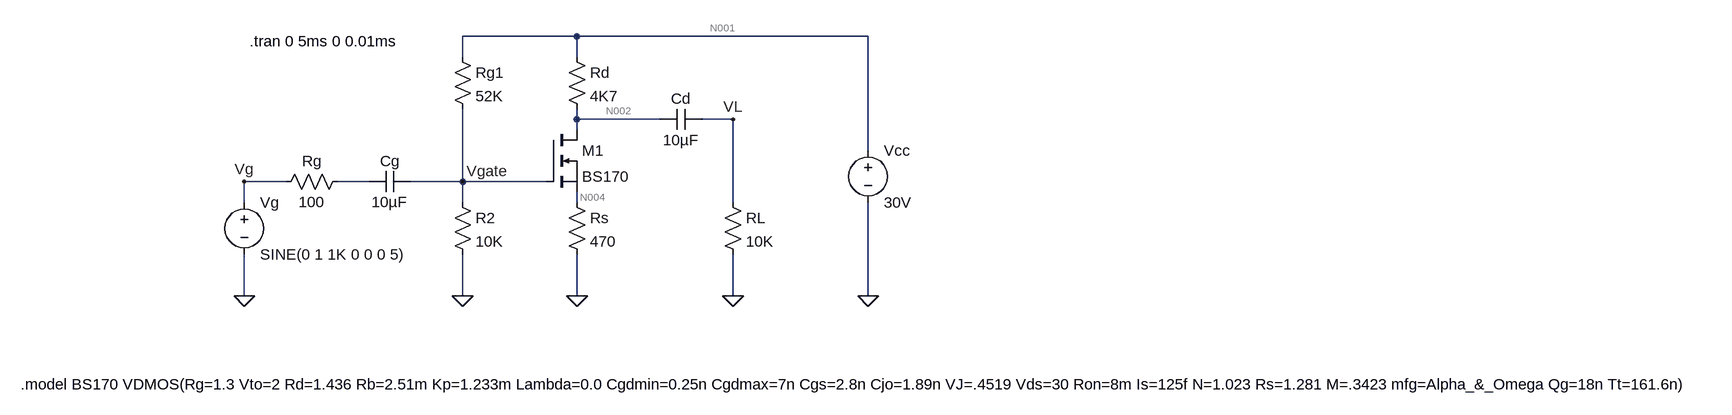
[diagram p0: schematic TPMOS3.asc]
TPMOS3.asc, the LTspice schematic file:
Version 4
SHEET 1 2460 680
WIRE 496 -128 320 -128
WIRE 944 -128 496 -128
WIRE 320 -96 320 -128
WIRE 496 -96 496 -128
WIRE 496 0 496 -16
WIRE 624 0 496 0
WIRE 736 0 688 0
WIRE 496 16 496 0
WIRE 944 48 944 -128
WIRE 48 96 -16 96
WIRE 176 96 128 96
WIRE 320 96 320 -16
WIRE 320 96 240 96
WIRE 448 96 320 96
WIRE -16 128 -16 96
WIRE 320 128 320 96
WIRE 496 128 496 112
WIRE 736 128 736 0
WIRE -16 272 -16 208
WIRE 320 272 320 208
WIRE 496 272 496 208
WIRE 736 272 736 208
WIRE 944 272 944 128
FLAG -16 272 0
FLAG 320 272 0
FLAG 496 272 0
FLAG 736 272 0
FLAG 944 272 0
FLAG 320 96 Vgate
FLAG 736 0 VL
FLAG -16 96 Vg
SYMBOL voltage -16 112 R0
WINDOW 123 0 0 Left 0
WINDOW 39 0 0 Left 0
SYMATTR InstName Vg
SYMATTR Value SINE(0 1 1K 0 0 0 5)
SYMBOL res 144 80 R90
WINDOW 0 0 56 VBottom 2
WINDOW 3 32 56 VTop 2
SYMATTR InstName Rg
SYMATTR Value 100
SYMBOL cap 240 80 R90
WINDOW 0 0 32 VBottom 2
WINDOW 3 32 32 VTop 2
SYMATTR InstName Cg
SYMATTR Value 10µF
SYMBOL res 304 112 R0
SYMATTR InstName R2
SYMATTR Value 10K
SYMBOL res 304 -112 R0
SYMATTR InstName Rg1
SYMATTR Value 52K
SYMBOL nmos 448 16 R0
SYMATTR InstName M1
SYMATTR Value BS170
SYMBOL res 480 112 R0
SYMATTR InstName Rs
SYMATTR Value 470
SYMBOL res 480 -112 R0
SYMATTR InstName Rd
SYMATTR Value 4K7
SYMBOL cap 688 -16 R90
WINDOW 0 0 32 VBottom 2
WINDOW 3 32 32 VTop 2
SYMATTR InstName Cd
SYMATTR Value 10µF
SYMBOL res 720 112 R0
SYMATTR InstName RL
SYMATTR Value 10K
SYMBOL voltage 944 32 R0
SYMATTR InstName Vcc
SYMATTR Value 30V
TEXT -360 408 Left 2 !.model BS170 VDMOS(Rg=1.3 Vto=2 Rd=1.436 Rb=2.51m Kp=1.233m Lambda=0.0 Cgdmin=0.25n Cgdmax=7n Cgs=2.8n Cjo=1.89n VJ=.4519 Vds=30 Ron=8m Is=125f N=1.023 Rs=1.281 M=.3423 mfg=Alpha_&_Omega Qg=18n Tt=161.6n)
TEXT -8 -120 Left 2 !.tran 0 5ms 0 0.01ms

The netlist it stands for:
* TPMOS3.asc
Vg Vg 0 SINE(0 1 1K 0 0 0 5)
Rg N003 Vg 100
Cg Vgate N003 10µF
R2 Vgate 0 10K
Rg1 N001 Vgate 52K
M1 N002 Vgate N004 N004 BS170
Rs N004 0 470
Rd N001 N002 4K7
Cd VL N002 10µF
RL VL 0 10K
Vcc N001 0 30V
.model NMOS NMOS
.model PMOS PMOS
.lib standard.mos
.model BS170 VDMOS(Rg=1.3 Vto=2 Rd=1.436 Rb=2.51m Kp=1.233m Lambda=0.0 Cgdmin=0.25n Cgdmax=7n Cgs=2.8n Cjo=1.89n VJ=.4519 Vds=30 Ron=8m Is=125f N=1.023 Rs=1.281 M=.3423 mfg=Alpha_&_Omega Qg=18n Tt=161.6n)
.tran 0 5ms 0 0.01ms
.backanno
.end

* Results of the author's LTspice run, read from the files saved beside the schematic
* Operating Point, zero values left out:
*   V(vgate) = 4.839 V
*   V(n001) = 30 V
*   V(n002) = 20.11 V
*   V(n004) = 988.8 mV
*   Id(M1) = 2.104 mA
*   Is(M1) = -2.104 mA
*   I(R2) = 483.9 µA
*   I(Rg1) = 483.9 µA
*   I(Rs) = 2.104 mA
*   I(Rd) = 2.104 mA
*   I(Vcc) = -2.588 mA